# Altium schematic sheet Temp-measurement.SchDoc
size A4
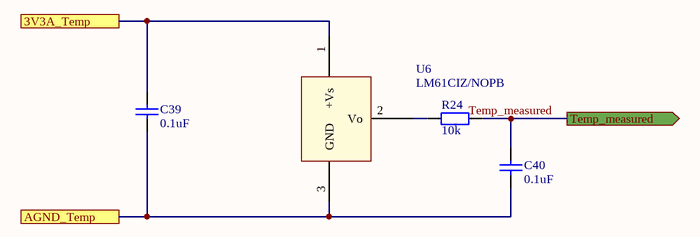
[diagram p0: Temp-measurement.SchDoc]

## Parts
C39  0.1uF  [FP_0805_CAP_085]
C40  0.1uF  [FP_0805_CAP_085]
R24  10k  [FP_0805_RES]
U6  LM61CIZ/NOPB  [TO-92]

## Ports
3V3A_Temp, AGND_Temp, Temp_measured (out)

## Nets
3V3A_Temp: C39.1 U6.1(+Vs) ; port 3V3A_Temp
AGND_Temp: C39.2 C40.2 U6.3(GND) ; port AGND_Temp
Temp_measured: C40.1 R24.1 ; port Temp_measured
NetR24_2: R24.2 U6.2(Vo)

## Library data of the parts
C39 C40 = CAP: Capacitor; Value: 0.1uF
R24 = RES: Resistor; Value: 10k
U6 = LM61CIZ/NOPB: Temperature Sensor; K_Manufacturer: Texas Instruments; Order Code: 761-6034; Distributor: RS components; Package: TO-92; CompType: LM61CIZ/NOPB